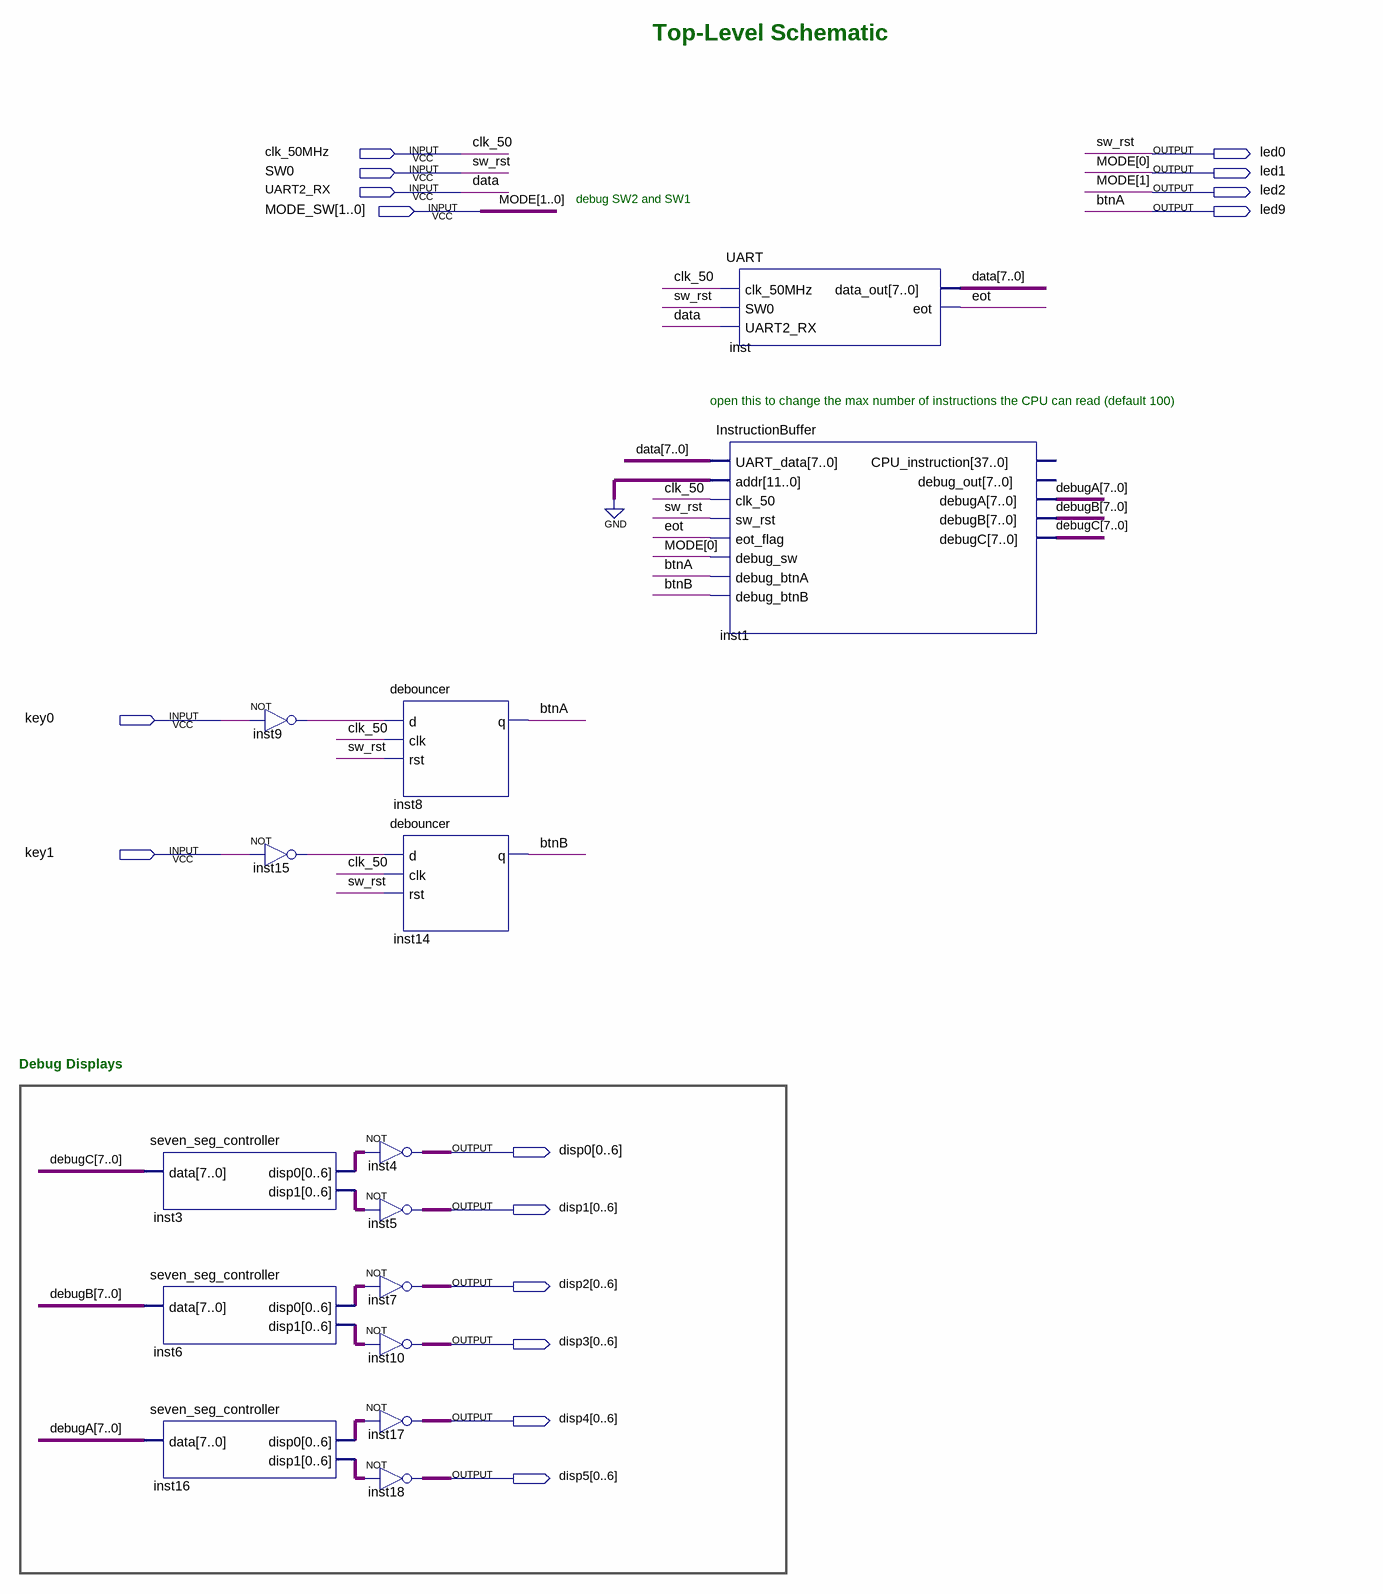
[diagram p0: schematic sheet]
// Quartus schematic TopLevel.bdf as structural Verilog: 15 symbols, 16 pins
module TopLevel (
  input  clk_50MHz,
  input  SW0,
  input  UART2_RX,
  input  [1:0] MODE_SW,
  input  key0,
  input  key1,
  output led0,
  output led1,
  output led2,
  output led9,
  output [0:6] disp0,
  output [0:6] disp1,
  output [0:6] disp2,
  output [0:6] disp3,
  output [0:6] disp4,
  output [0:6] disp5
);

  wire btnB, eot, inst9_out, inst15_out;
  wire [6:0] inst3_disp0, inst3_disp1, inst6_disp0, inst6_disp1, inst16_disp0, inst16_disp1;
  wire [7:0] data, debugA, debugB, debugC;

  seven_seg_controller inst3 (.data(debugC), .disp0(inst3_disp0), .disp1(inst3_disp1));
  seven_seg_controller inst6 (.data(debugB), .disp0(inst6_disp0), .disp1(inst6_disp1));
  seven_seg_controller inst16 (.data(debugA), .disp0(inst16_disp0), .disp1(inst16_disp1));
  not inst9 (inst9_out, key0);
  not inst15 (inst15_out, key1);
  debouncer inst8 (.d(inst9_out), .clk(clk_50MHz), .rst(SW0), .q(led9));
  debouncer inst14 (.d(inst15_out), .clk(clk_50MHz), .rst(SW0), .q(btnB));
  assign disp0 = ~inst3_disp0;  // NOT inst4, 7 bits wide
  assign disp1 = ~inst3_disp1;  // NOT inst5, 7 bits wide
  assign disp2 = ~inst6_disp0;  // NOT inst7, 7 bits wide
  assign disp3 = ~inst6_disp1;  // NOT inst10, 7 bits wide
  assign disp4 = ~inst16_disp0;  // NOT inst17, 7 bits wide
  assign disp5 = ~inst16_disp1;  // NOT inst18, 7 bits wide
  UART inst (.clk_50MHz(clk_50MHz), .SW0(SW0), .UART2_RX(UART2_RX), .data_out(data), .eot(eot));
  InstructionBuffer inst1 (
    .UART_data(data), .addr({12{1'b0}}), .clk_50(clk_50MHz), .sw_rst(SW0), .eot_flag(eot),
    .debug_sw(MODE_SW[0]), .debug_btnA(led9), .debug_btnB(btnB), .debugA(debugA), .debugB(debugB),
    .debugC(debugC));  // open: CPU_instruction, debug_out

  assign led0 = SW0;
  assign led1 = MODE_SW[0];
  assign led2 = MODE_SW[1];

  // Other names for the same wires on the sheet: btnA = led9; clk_50 = clk_50MHz; data = UART2_RX;
  //   MODE[1:0] = MODE_SW; sw_rst = SW0

  // Notes on the sheet:
  //   Top-Level Schematic
  //   debug SW2 and SW1
  //   open this to change the max number of instructions the CPU can read (default 100)
  //   Debug Displays
endmodule
